# Altium schematic sheet Pre-regulation.SchDoc
size A
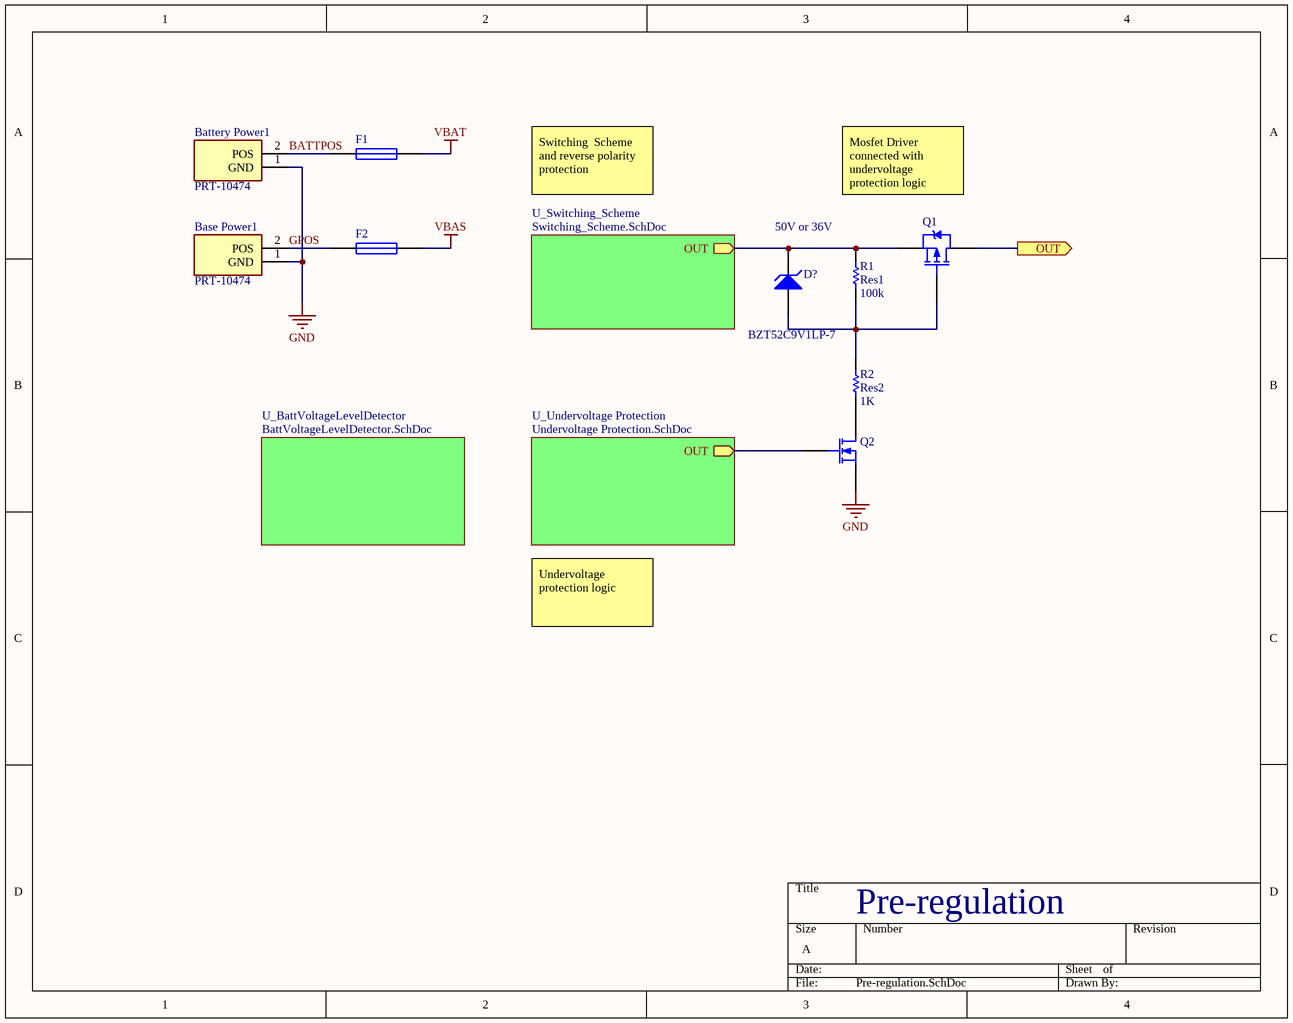
[diagram p0: Pre-regulation.SchDoc]

## Parts
Base_Power1  PRT-10474  [PRT-10474]
Battery_Power1  PRT-10474  [PRT-10474]
D?  BZT52C9V1LP-7  [0402]
F1  Battery Power Fuse  [14-1210]  (value not drawn)
F2  Ground Power Fuse  [14-1210]  (value not drawn)
Q1  Power PMOS  [TO-220AB]  (value not drawn)
Q2  Low power NMOS  [SOT23_L]  (value not drawn)
R1  Res1  value 100k  [0402]
R2  Res2  value 1K  [0402]

## Sub-sheets
U_BattVoltageLevelDetector = BattVoltageLevelDetector.SchDoc: no entries
U_Switching_Scheme = Switching_Scheme.SchDoc: OUT (out)
U_Undervoltage Protection = Undervoltage Protection.SchDoc: OUT (out)

## Ports
OUT (out)

## Nets
GND: Base_Power1.1(GND) Battery_Power1.1(GND) Q2.3(S)
VBAS: F2.2
VBAT: F1.2
BATTPOS: Battery_Power1.2(POS) F1.1
GPOS: Base_Power1.2(POS) F2.1
OUT: Q1.2(D) ; port OUT
NetD?_1: D?.1(A) Q1.1(G) R1.1 R2.2
NetD?_2: D?.2(K) Q1.3(S) R1.2 ; sheet U_Switching_Scheme/OUT
NetQ2_1: Q2.1(D) R2.1
NetQ2_2: Q2.2(G) ; sheet U_Undervoltage Protection/OUT

## Notes on the sheet
- Switching  Scheme and reverse polarity protection
- 50V or 36V
- Mosfet Driver connected with undervoltage protection logic
- Undervoltage protection logic
- Pre-regulation

## Library data of the parts
Base_Power1 Battery_Power1 = PRT-10474: Connector; Manufacturer_Name: SparkFun; Datasheet Link: http://cdn.sparkfun.com/datasheets/Prototyping/xt60.pdf; Height: 15.875mm; Manufacturer_Part_Number: PRT-10474; Mouser Part Number: 474-PRT-10474; Mouser Price/Stock: https://www.mouser.com/Search/Refine.aspx?Keyword=474-PRT-10474
D? = D Zener: Zener Diode 9.1V 250mW ±6% Surface Mount X1-DFN1006-2; MFG: Diodes Incorporated; Package: 0402; MFG PN: BZT52C9V1LP-7
F1 F2 = Fuse 1: Fuse; Published: 8-Jun-2000; LatestRevisionDate: 17-Jul-2002; LatestRevisionNote: Re-released for DXP Platform.; PackageReference: PIN-W2/E2.8; Publisher: Altium Limited; PackageDescription: Thru-Hole; 2 Leads
Q1 = PMOS-2: P-Channel Power MOSFET; Note: Pin 4 not drawn and electrically connected to Pin 2.; Published: 8-Jun-2000; LatestRevisionDate: 17-Jul-2002; LatestRevisionNote: Re-released for DXP Platform.; DatasheetVersion: PD-9.390D; PackageVersion: Feb-1997; PackageReference: TO-220AB; Publisher: Altium Limited; PackageDescription: TO, Thru-Hole, Vertical, Heatsink Mounted; 3 In-Line Leads; Pitch 2.54 mm; ComponentLink1Description: Manufacturer Link; ComponentLink1URL: http://www.irf.com/
Q2 = MOSFET-N: N-Channel MOSFET; Published: 8-Jun-2000; LatestRevisionDate: 17-Jul-2002; LatestRevisionNote: Re-released for DXP Platform.; PackageVersion: 1995/1996; PackageReference: E3; Publisher: Altium Limited; PackageDescription: TO, Flat Index; 3 In-Line, Axial Leads; Body Dia. 4.6mm; Lead Dia. 0.5 mm (max)
R1 R2 = Res1: Resistor; Published: 8-Jun-2000; LatestRevisionDate: 17-Jul-2002; LatestRevisionNote: Re-released for DXP Platform.; PackageReference: AXIAL-0.3; Publisher: Altium Limited; PackageDescription: Axial Device, Thru-Hole; 2 Leads; 0.3 in Pin Spacing